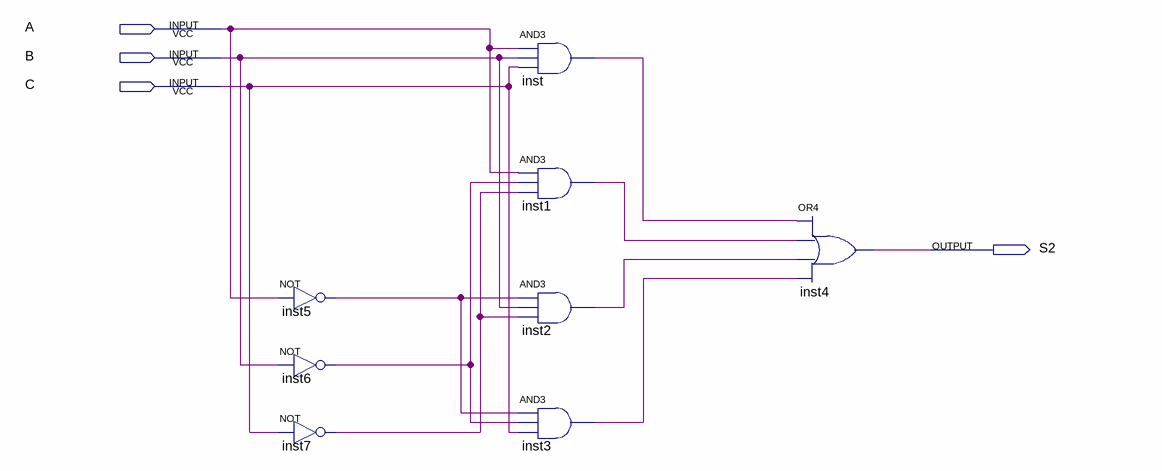
[diagram p0: schematic sheet]
// Quartus schematic S2.bdf as structural Verilog: 8 symbols, 4 pins
module S2 (
  input  A,
  input  B,
  input  C,
  output S2
);

  wire inst1_out, inst2_out, inst3_out, inst5_out, inst6_out, inst7_out, inst_out;

  not inst5 (inst5_out, A);
  not inst6 (inst6_out, B);
  not inst7 (inst7_out, C);
  and inst (inst_out, A, B, C);
  and inst1 (inst1_out, A, inst6_out, inst7_out);
  and inst2 (inst2_out, inst5_out, B, inst7_out);
  and inst3 (inst3_out, inst5_out, inst6_out, C);
  or inst4 (S2, inst_out, inst1_out, inst2_out, inst3_out);
endmodule
